# Altium schematic sheet decouple_caps.SchDoc
size A4
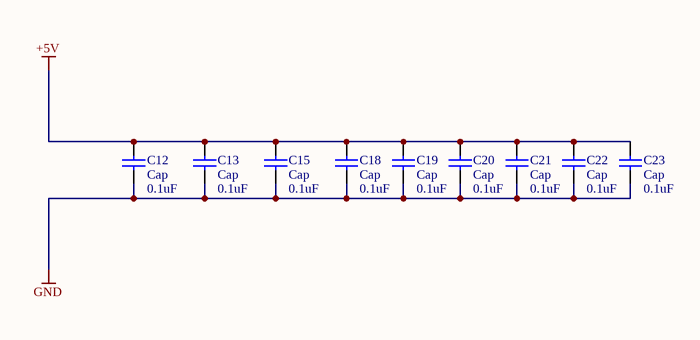
[diagram p0: decouple_caps.SchDoc]

## Parts
C12  Cap  value 0.1uF  [C0805]
C13  Cap  value 0.1uF  [C0805]
C15  Cap  value 0.1uF  [C0805]
C18  Cap  value 0.1uF  [C0805]
C19  Cap  value 0.1uF  [C0805]
C20  Cap  value 0.1uF  [C0805]
C21  Cap  value 0.1uF  [C0805]
C22  Cap  value 0.1uF  [C0805]
C23  Cap  value 0.1uF  [C0805]

## Nets
+5V: C12.2 C13.2 C15.2 C18.2 C19.2 C20.2 C21.2 C22.2 C23.2
GND: C12.1 C13.1 C15.1 C18.1 C19.1 C20.1 C21.1 C22.1 C23.1

## Library data of the parts
C12 C13 C15 C18-C23 = Cap: Capacitor; Published: 8-Jun-2000; LatestRevisionDate: 17-Jul-2002; LatestRevisionNote: Re-released for DXP Platform.; PackageReference: RAD-0.3; Publisher: Altium Limited; PackageDescription: Radial Cap, Thru-Hole; 2 Leads; 0.3 in Pin Spacing